# EAGLE schematic single-spi-interface (EAGLE 6.5.0)
DESIGNER: JONNEW, MWL@MIT; DESIGN_NAME: spi-interface (2x64_hirose-circular); LICENSE: (c) Jon Newman CC-BY-SA-NC 4.0; REVISION: 1.2
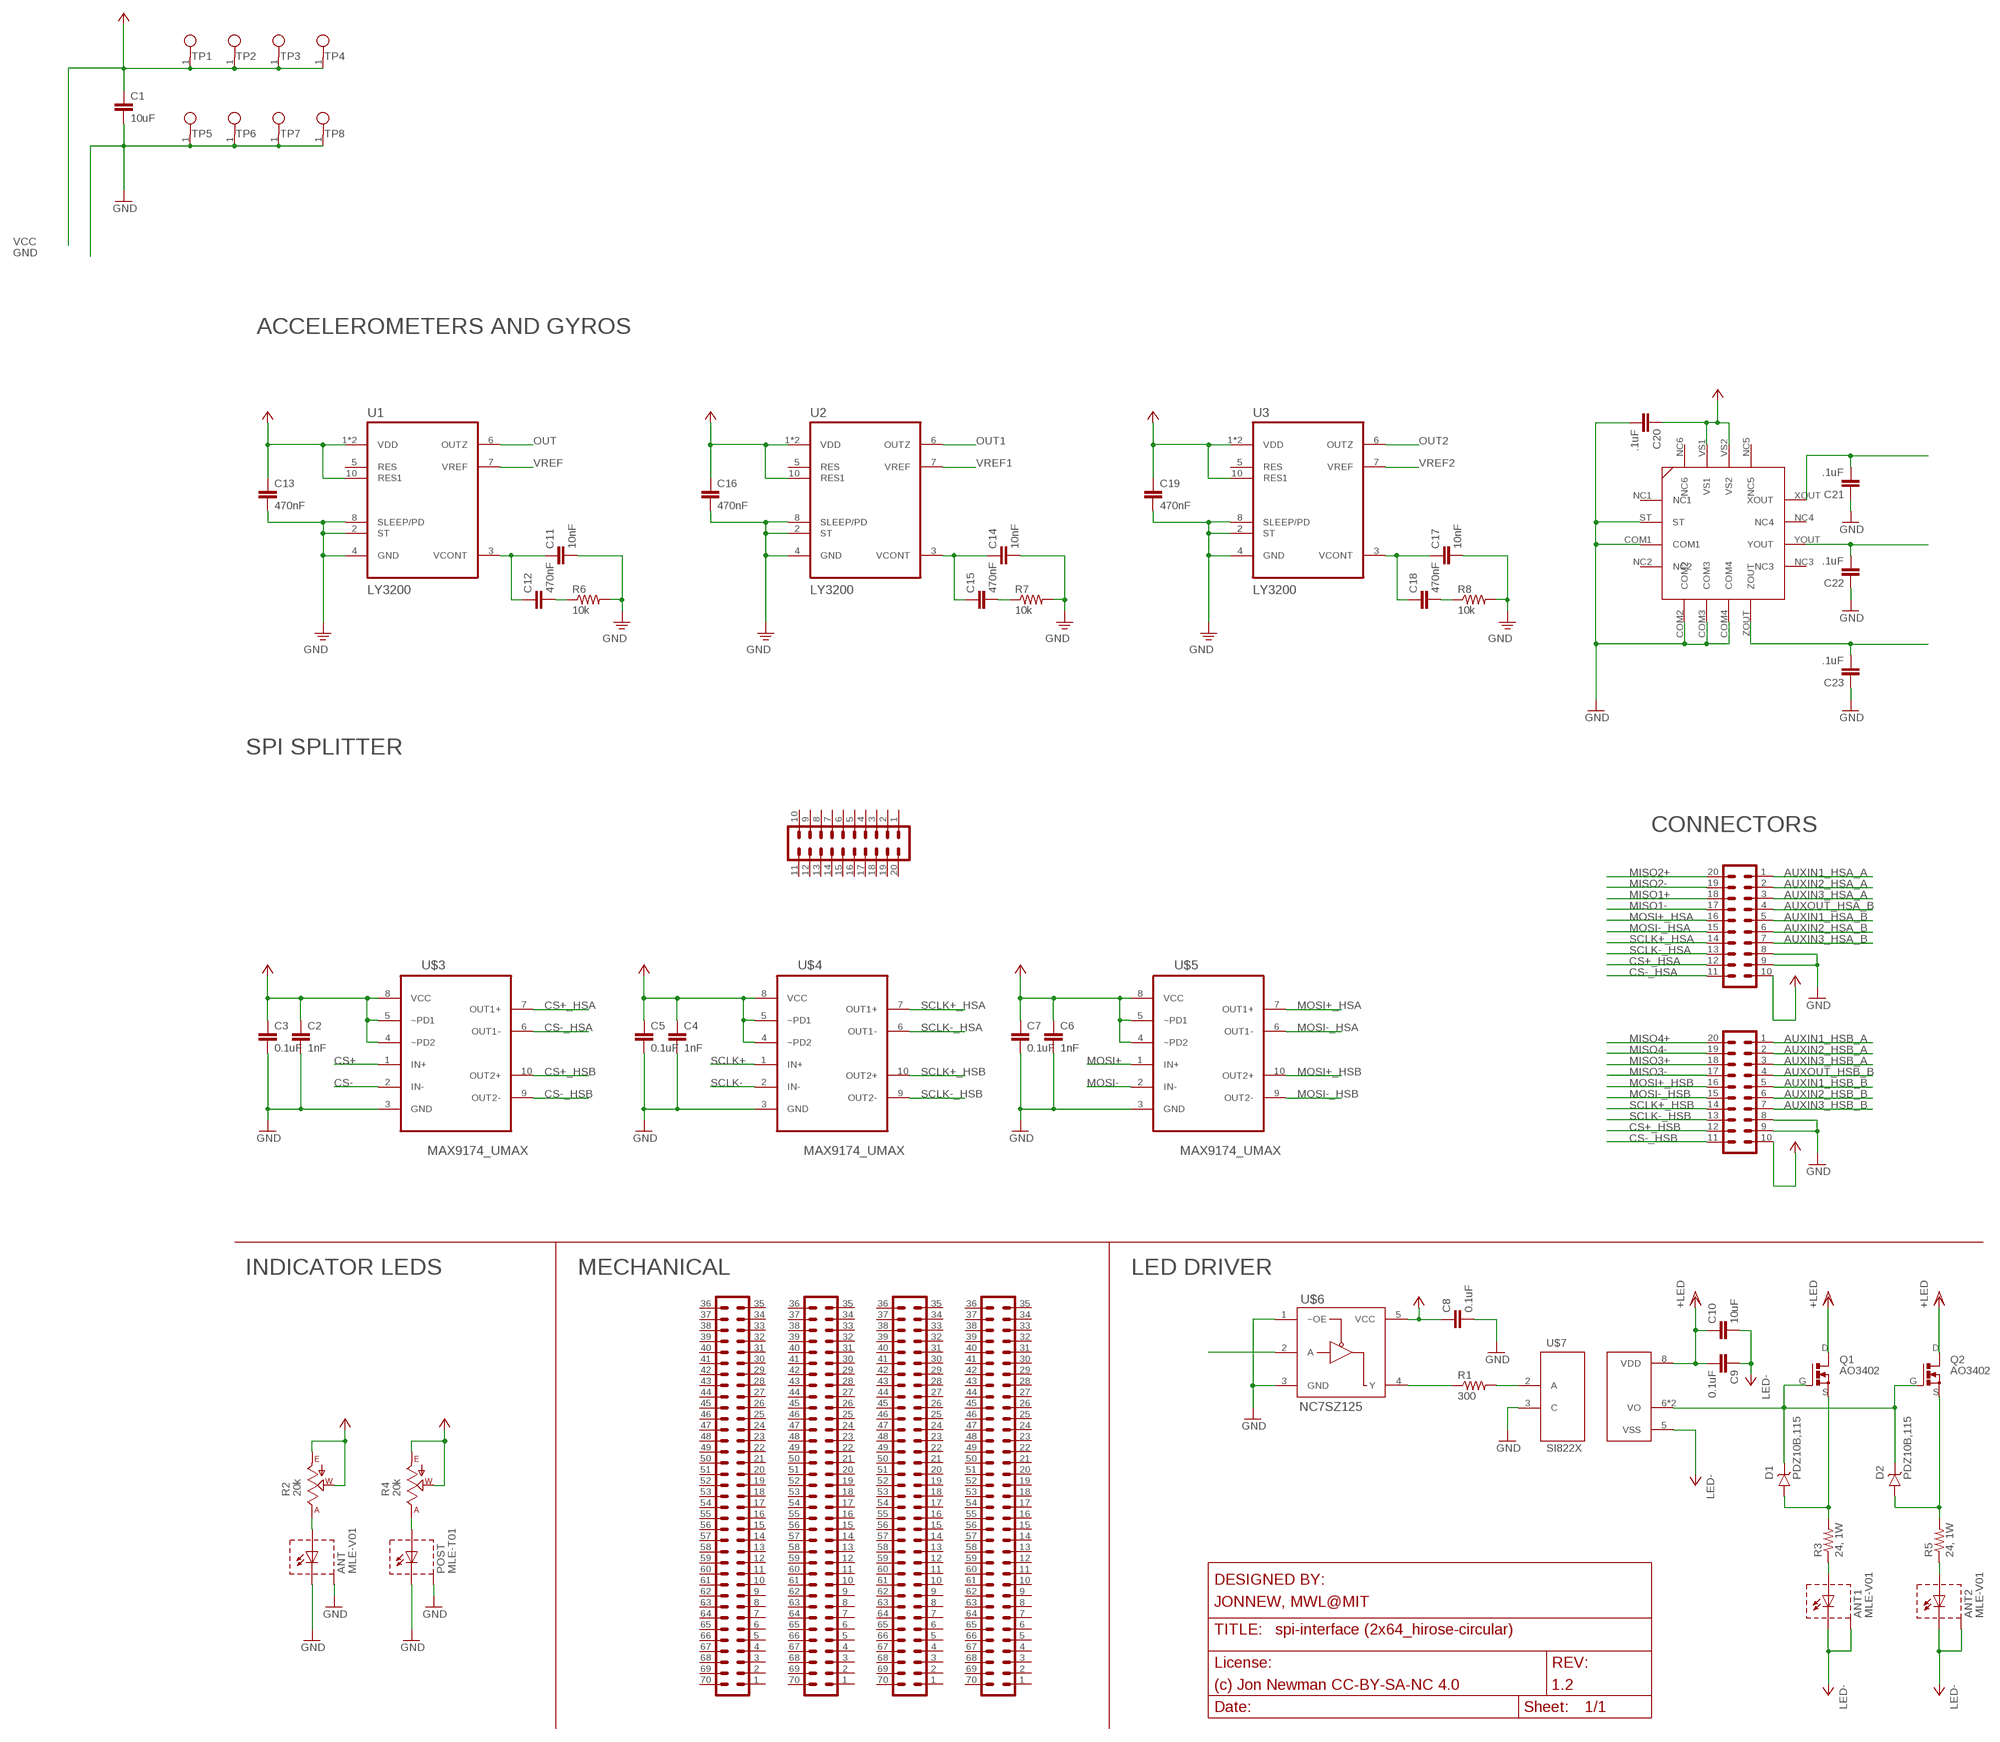
[diagram p0: schematic, sheet 1]

## Parts
ANT  MLE-V01  LED_PKG-BODY  [LED-MLE]
ANT1  MLE-V01  LED_PKG-BODY  [LED-MLE]
ANT2  MLE-V01  LED_PKG-BODY  [LED-MLE]
C1  10uF  C_0805  [0805]
C2  1nF  C_0402  [0402]
C3  0.1uF  C_0402  [0402]
C4  1nF  C_0402  [0402]
C5  0.1uF  C_0402  [0402]
C6  1nF  C_0402  [0402]
C7  0.1uF  C_0402  [0402]
C8  0.1uF  C_0402  [0402]
C9  0.1uF  C_0402  [0402]
C10  10uF  C_0805  [0805]
C11  10nF  C_0201  [0201]
C12  470nF  C_0201  [0201]
C13  470nF  C_0201  [0201]
C14  10nF  C_0201  [0201]
C15  470nF  C_0201  [0201]
C16  470nF  C_0201  [0201]
C17  10nF  C_0201  [0201]
C18  470nF  C_0201  [0201]
C19  470nF  C_0201  [0201]
C20  .1uF  C_0402  [0402]
C21  .1uF  C_0201  [0201]
C22  .1uF  C_0201  [0201]
C23  .1uF  C_0201  [0201]
D1  PDZ10B,115  Z-DIODE_SOD-323  [SOD-323]
D2  PDZ10B,115  Z-DIODE_SOD-323  [SOD-323]
DIO_E1B  PINHD-2X10_DF40-20REC  [DF40-20REC]
DIO_E1B1  PINHD-2X10_DF40-20REC  [DF40-20REC]
MECH_E0B  PINHD-2X35_DF40REC  [DF40-70REC]
MECH_N0B  PINHD-2X35_DF40REC  [DF40-70REC]
MECH_S0B  PINHD-2X35_DF40REC  [DF40-70REC]
MECH_W0B  PINHD-2X35_DF40REC  [DF40-70REC]
POST  MLE-T01  LED_PKG-BODY  [LED-MLE]
Q1  AO3402  N-MOSFET_SOT23-GSD  [SOT23-GSD]
Q2  AO3402  N-MOSFET_SOT23-GSD  [SOT23-GSD]
R1  300  R_0402  [0402]
R2  20k  TRIM_US-SM-42/43W  [SM-42/43W]
R3  24, 1W  R_0402  [0402]
R4  20k  TRIM_US-SM-42/43W  [SM-42/43W]
R5  24, 1W  R_0402  [0402]
R6  10k  R_0201  [0201]
R7  10k  R_0201  [0201]
R8  10k  R_0201  [0201]
TP1  TESTPOINT_SMALL  [TESTPOINT_SMALL]
TP2  TESTPOINT_SMALL  [TESTPOINT_SMALL]
TP3  TESTPOINT_SMALL  [TESTPOINT_SMALL]
TP4  TESTPOINT_SMALL  [TESTPOINT_SMALL]
TP5  TESTPOINT_SMALL  [TESTPOINT_SMALL]
TP6  TESTPOINT_SMALL  [TESTPOINT_SMALL]
TP7  TESTPOINT_SMALL  [TESTPOINT_SMALL]
TP8  TESTPOINT_SMALL  [TESTPOINT_SMALL]
U1  LY3200  LY3200ALH_LGA-10-COMPACT  [LGA-10-COMPACT]
U2  LY3200  LY3200ALH_LGA-10-COMPACT  [LGA-10-COMPACT]
U3  LY3200  LY3200ALH_LGA-10-COMPACT  [LGA-10-COMPACT]
U4  ADXL335  [ADXL335]
U$2  PINHD-2X10_T1M  [T1M-10-T-DV]
U$3  MAX9174_UMAX  [10-UMAX]
U$4  MAX9174_UMAX  [10-UMAX]
U$5  MAX9174_UMAX  [10-UMAX]
U$6  NC7SZ125  [SOT-23-5]
U$7  SI822X  [SOIC127P500X400-8N]

## Nets
AUXIN1_HSA_A: DIO_E1B.1
AUXIN1_HSA_B: DIO_E1B.5
AUXIN1_HSB_A: DIO_E1B1.1
AUXIN1_HSB_B: DIO_E1B1.5
AUXIN2_HSA_A: DIO_E1B.2
AUXIN2_HSA_B: DIO_E1B.6
AUXIN2_HSB_A: DIO_E1B1.2
AUXIN2_HSB_B: DIO_E1B1.6
AUXIN3_HSA_A: DIO_E1B.3
AUXIN3_HSA_B: DIO_E1B.7
AUXIN3_HSB_A: DIO_E1B1.3
AUXIN3_HSB_B: DIO_E1B1.7
AUXOUT_HSA_B: DIO_E1B.4
AUXOUT_HSB_B: DIO_E1B1.4
CS+: U$3.1(IN+)
CS+_HSA: DIO_E1B.12 U$3.7(OUT1+)
CS+_HSB: DIO_E1B1.12 U$3.10(OUT2+)
CS-: U$3.2(IN-)
CS-_HSA: DIO_E1B.11 U$3.6(OUT1-)
CS-_HSB: DIO_E1B1.11 U$3.9(OUT2-)
GND: ANT.C1(C) ANT.C2(C) ANT.HS(BODY) C1.2 C2.2 C3.2 C4.2 C5.2 C6.2 C7.2 C8.2 C11.2 C13.2 C14.2 C16.2 C17.2 C19.2 C20.2 C21.1 C22.1 C23.1 DIO_E1B1.8 DIO_E1B1.9 DIO_E1B.8 DIO_E1B.9 POST.C1(C) POST.C2(C) POST.HS(BODY) R6.2 R7.2 R8.2 TP5.1 TP6.1 TP7.1 TP8.1 U1.2(ST) U1.4(GND) U1.8(SLEEP/PD) U2.2(ST) U2.4(GND) U2.8(SLEEP/PD) U3.2(ST) U3.4(GND) U3.8(SLEEP/PD) U4.COM1 U4.COM2 U4.COM3 U4.COM4 U4.ST U$3.3(GND) U$4.3(GND) U$5.3(GND) U$6.1(~OE) U$6.3(GND) U$7.3(C)
MISO1+: DIO_E1B.18
MISO1-: DIO_E1B.17
MISO2+: DIO_E1B.20
MISO2-: DIO_E1B.19
MISO3+: DIO_E1B1.18
MISO3-: DIO_E1B1.17
MISO4+: DIO_E1B1.20
MISO4-: DIO_E1B1.19
MOSI+: U$5.1(IN+)
MOSI+_HSA: DIO_E1B.16 U$5.7(OUT1+)
MOSI+_HSB: DIO_E1B1.16 U$5.10(OUT2+)
MOSI-: U$5.2(IN-)
MOSI-_HSA: DIO_E1B.15 U$5.6(OUT1-)
MOSI-_HSB: DIO_E1B1.15 U$5.9(OUT2-)
N$1: R1.2 U$7.2(A)
N$2: C11.1 C12.1 U1.3(VCONT)
N$3: ANT1.A1(A) ANT1.A2(A) R3.1
N$4: D1.A Q1.S R3.2
N$5: U$6.2(A)
N$6: R1.1 U$6.4(Y)
N$7: D1.C D2.C Q1.G Q2.G U$7.6(VO) U$7.7(VO)
N$8: C12.2 R6.1
N$9: ANT.A1(A) ANT.A2(A) R2.1(A)
N$10: C14.1 C15.1 U2.3(VCONT)
N$11: D2.A Q2.S R5.2
N$12: ANT2.A1(A) ANT2.A2(A) R5.1
N$13: POST.A1(A) POST.A2(A) R4.1(A)
N$14: C15.2 R7.1
N$15: C17.1 C18.1 U3.3(VCONT)
N$16: C18.2 R8.1
OUT: U1.6(OUTZ)
OUT1: U2.6(OUTZ)
OUT2: U3.6(OUTZ)
SCLK+: U$4.1(IN+)
SCLK+_HSA: DIO_E1B.14 U$4.7(OUT1+)
SCLK+_HSB: DIO_E1B1.14 U$4.10(OUT2+)
SCLK-: U$4.2(IN-)
SCLK-_HSA: DIO_E1B.13 U$4.6(OUT1-)
SCLK-_HSB: DIO_E1B1.13 U$4.9(OUT2-)
VCC: C1.1 C2.1 C3.1 C4.1 C5.1 C6.1 C7.1 C8.1 C13.1 C16.1 C19.1 C20.1 DIO_E1B1.10 DIO_E1B.10 R2.2(W) R2.3(E) R4.2(W) R4.3(E) TP1.1 TP2.1 TP3.1 TP4.1 U1.1(VDD) U1.9(VDD) U1.10(RES1) U2.1(VDD) U2.9(VDD) U2.10(RES1) U3.1(VDD) U3.9(VDD) U3.10(RES1) U4.VS1 U4.VS2 U$3.4(~PD2) U$3.5(~PD1) U$3.8(VCC) U$4.4(~PD2) U$4.5(~PD1) U$4.8(VCC) U$5.4(~PD2) U$5.5(~PD1) U$5.8(VCC) U$6.5(VCC)
VDD: C9.2 C10.1 Q1.D Q2.D U$7.8(VDD) ; supply symbol labelled +LED
VREF: U1.7(VREF)
VREF1: U2.7(VREF)
VREF2: U3.7(VREF)
VSS: ANT1.C1(C) ANT1.C2(C) ANT1.HS(BODY) ANT2.C1(C) ANT2.C2(C) ANT2.HS(BODY) C9.1 C10.2 U$7.5(VSS) ; supply symbol labelled LED-
XOUT1: C21.2 U4.XOUT
YOUT1: C22.2 U4.YOUT
ZOUT1: C23.2 U4.ZOUT
Unconnected: MECH_E0B.1 MECH_E0B.2 MECH_E0B.3 MECH_E0B.4 MECH_E0B.5 MECH_E0B.6 MECH_E0B.7 MECH_E0B.8 MECH_E0B.9 MECH_E0B.10 MECH_E0B.11 MECH_E0B.12 MECH_E0B.13 MECH_E0B.14 MECH_E0B.15 MECH_E0B.16 MECH_E0B.17 MECH_E0B.18 MECH_E0B.19 MECH_E0B.20 MECH_E0B.21 MECH_E0B.22 MECH_E0B.23 MECH_E0B.24 MECH_E0B.25 MECH_E0B.26 MECH_E0B.27 MECH_E0B.28 MECH_E0B.29 MECH_E0B.30 MECH_E0B.31 MECH_E0B.32 MECH_E0B.33 MECH_E0B.34 MECH_E0B.35 MECH_E0B.36 MECH_E0B.37 MECH_E0B.38 MECH_E0B.39 MECH_E0B.40 MECH_E0B.41 MECH_E0B.42 MECH_E0B.43 MECH_E0B.44 MECH_E0B.45 MECH_E0B.46 MECH_E0B.47 MECH_E0B.48 MECH_E0B.49 MECH_E0B.50 MECH_E0B.51 MECH_E0B.52 MECH_E0B.53 MECH_E0B.54 MECH_E0B.55 MECH_E0B.56 MECH_E0B.57 MECH_E0B.58 MECH_E0B.59 MECH_E0B.60 MECH_E0B.61 MECH_E0B.62 MECH_E0B.63 MECH_E0B.64 MECH_E0B.65 MECH_E0B.66 MECH_E0B.67 MECH_E0B.68 MECH_E0B.69 MECH_E0B.70 MECH_N0B.1 MECH_N0B.2 MECH_N0B.3 MECH_N0B.4 MECH_N0B.5 MECH_N0B.6 MECH_N0B.7 MECH_N0B.8 MECH_N0B.9 MECH_N0B.10 MECH_N0B.11 MECH_N0B.12 MECH_N0B.13 MECH_N0B.14 MECH_N0B.15 MECH_N0B.16 MECH_N0B.17 MECH_N0B.18 MECH_N0B.19 MECH_N0B.20 MECH_N0B.21 MECH_N0B.22 MECH_N0B.23 MECH_N0B.24 MECH_N0B.25 MECH_N0B.26 MECH_N0B.27 MECH_N0B.28 MECH_N0B.29 MECH_N0B.30 MECH_N0B.31 MECH_N0B.32 MECH_N0B.33 MECH_N0B.34 MECH_N0B.35 MECH_N0B.36 MECH_N0B.37 MECH_N0B.38 MECH_N0B.39 MECH_N0B.40 MECH_N0B.41 MECH_N0B.42 MECH_N0B.43 MECH_N0B.44 MECH_N0B.45 MECH_N0B.46 MECH_N0B.47 MECH_N0B.48 MECH_N0B.49 MECH_N0B.50 MECH_N0B.51 MECH_N0B.52 MECH_N0B.53 MECH_N0B.54 MECH_N0B.55 MECH_N0B.56 MECH_N0B.57 MECH_N0B.58 MECH_N0B.59 MECH_N0B.60 MECH_N0B.61 MECH_N0B.62 MECH_N0B.63 MECH_N0B.64 MECH_N0B.65 MECH_N0B.66 MECH_N0B.67 MECH_N0B.68 MECH_N0B.69 MECH_N0B.70 MECH_S0B.1 MECH_S0B.2 MECH_S0B.3 MECH_S0B.4 MECH_S0B.5 MECH_S0B.6 MECH_S0B.7 MECH_S0B.8 MECH_S0B.9 MECH_S0B.10 MECH_S0B.11 MECH_S0B.12 MECH_S0B.13 MECH_S0B.14 MECH_S0B.15 MECH_S0B.16 MECH_S0B.17 MECH_S0B.18 MECH_S0B.19 MECH_S0B.20 MECH_S0B.21 MECH_S0B.22 MECH_S0B.23 MECH_S0B.24 MECH_S0B.25 MECH_S0B.26 MECH_S0B.27 MECH_S0B.28 MECH_S0B.29 MECH_S0B.30 MECH_S0B.31 MECH_S0B.32 MECH_S0B.33 MECH_S0B.34 MECH_S0B.35 MECH_S0B.36 MECH_S0B.37 MECH_S0B.38 MECH_S0B.39 MECH_S0B.40 MECH_S0B.41 MECH_S0B.42 MECH_S0B.43 MECH_S0B.44 MECH_S0B.45 MECH_S0B.46 MECH_S0B.47 MECH_S0B.48 MECH_S0B.49 MECH_S0B.50 MECH_S0B.51 MECH_S0B.52 MECH_S0B.53 MECH_S0B.54 MECH_S0B.55 MECH_S0B.56 MECH_S0B.57 MECH_S0B.58 MECH_S0B.59 MECH_S0B.60 MECH_S0B.61 MECH_S0B.62 MECH_S0B.63 MECH_S0B.64 MECH_S0B.65 MECH_S0B.66 MECH_S0B.67 MECH_S0B.68 MECH_S0B.69 MECH_S0B.70 MECH_W0B.1 MECH_W0B.2 MECH_W0B.3 MECH_W0B.4 MECH_W0B.5 MECH_W0B.6 MECH_W0B.7 MECH_W0B.8 MECH_W0B.9 MECH_W0B.10 MECH_W0B.11 MECH_W0B.12 MECH_W0B.13 MECH_W0B.14 MECH_W0B.15 MECH_W0B.16 MECH_W0B.17 MECH_W0B.18 MECH_W0B.19 MECH_W0B.20 MECH_W0B.21 MECH_W0B.22 MECH_W0B.23 MECH_W0B.24 MECH_W0B.25 MECH_W0B.26 MECH_W0B.27 MECH_W0B.28 MECH_W0B.29 MECH_W0B.30 MECH_W0B.31 MECH_W0B.32 MECH_W0B.33 MECH_W0B.34 MECH_W0B.35 MECH_W0B.36 MECH_W0B.37 MECH_W0B.38 MECH_W0B.39 MECH_W0B.40 MECH_W0B.41 MECH_W0B.42 MECH_W0B.43 MECH_W0B.44 MECH_W0B.45 MECH_W0B.46 MECH_W0B.47 MECH_W0B.48 MECH_W0B.49 MECH_W0B.50 MECH_W0B.51 MECH_W0B.52 MECH_W0B.53 MECH_W0B.54 MECH_W0B.55 MECH_W0B.56 MECH_W0B.57 MECH_W0B.58 MECH_W0B.59 MECH_W0B.60 MECH_W0B.61 MECH_W0B.62 MECH_W0B.63 MECH_W0B.64 MECH_W0B.65 MECH_W0B.66 MECH_W0B.67 MECH_W0B.68 MECH_W0B.69 MECH_W0B.70 U1.5(RES) U2.5(RES) U3.5(RES) U4.NC1 U4.NC2 U4.NC3 U4.NC4 U4.NC5 U4.NC6 U$2.1 U$2.2 U$2.3 U$2.4 U$2.5 U$2.6 U$2.7 U$2.8 U$2.9 U$2.10 U$2.11 U$2.12 U$2.13 U$2.14 U$2.15 U$2.16 U$2.17 U$2.18 U$2.19 U$2.20

## Notes on the sheet
- ACCELEROMETERS AND GYROS
- SPI SPLITTER
- CONNECTORS
- INDICATOR LEDS | MECHANICAL | LED DRIVER

## Library data of the parts
ANT ANT1 ANT2 POST = jonnew:LED_PKG-BODY
C1 = headstage:C: Capacitor; MN: TDK Corp.; PARTNO: C2012X5R1Cxxxxxxx; VID: DK
C2-C9 C11-C19 C21-C23 = jonnew:C: Capacitor
C10 = jonnew:C: Capacitor; MN: TDK Corp.; PARTNO: C2012X5R1Cxxxxxxx; VID: DK
C20 = headstage:C: Capacitor
D1 D2 = jonnew:Z-DIODE: Zener Diode
DIO_E1B DIO_E1B1 U$2 = jonnew:PINHD-2X10
MECH_E0B MECH_N0B MECH_S0B MECH_W0B = jonnew:PINHD-2X35
Q1 Q2 = jonnew:N-MOSFET: N-CHANNEL MOS FET SYMBOL
R1 R3 R5-R8 = jonnew:R: Resistor
R2 R4 = jonnew:TRIM_US-: POTENTIOMETER
TP1-TP8 = jonnew:TESTPOINT: PCB Test Point
U1-U3 = jonnew:LY3200ALH
U4 = jonnew:ADXL335: The ADXL335 is a small, thin, low power, complete 3-axis accelerometer with signal conditioned voltage outputs. The product measures acceleration with a minimum full-scale range of ±3 g. It can measure the static acceleration of gravity in tilt-sensing applications, as well as dynamic acceleration resulting from motion, shock, or vibration. The user selects the bandwidth of the accelerometer using the CX, CY, and CZ capacitors at the XOUT, YOUT, and ZOUT pins. Bandwidths can be selected to suit the application, with a range of 0.5 Hz to 1600 Hz for the X and Y axes, and a range of 0.5 Hz to 550 Hz for the Z axi
U$3-U$5 = jonnew:MAX9174
U$6 = jonnew:NC7SZ125
U$7 = jonnew:SI822X

## Net classes
1 thick: width 0.102 mm